# EAGLE schematic controls (EAGLE 6.6.0)
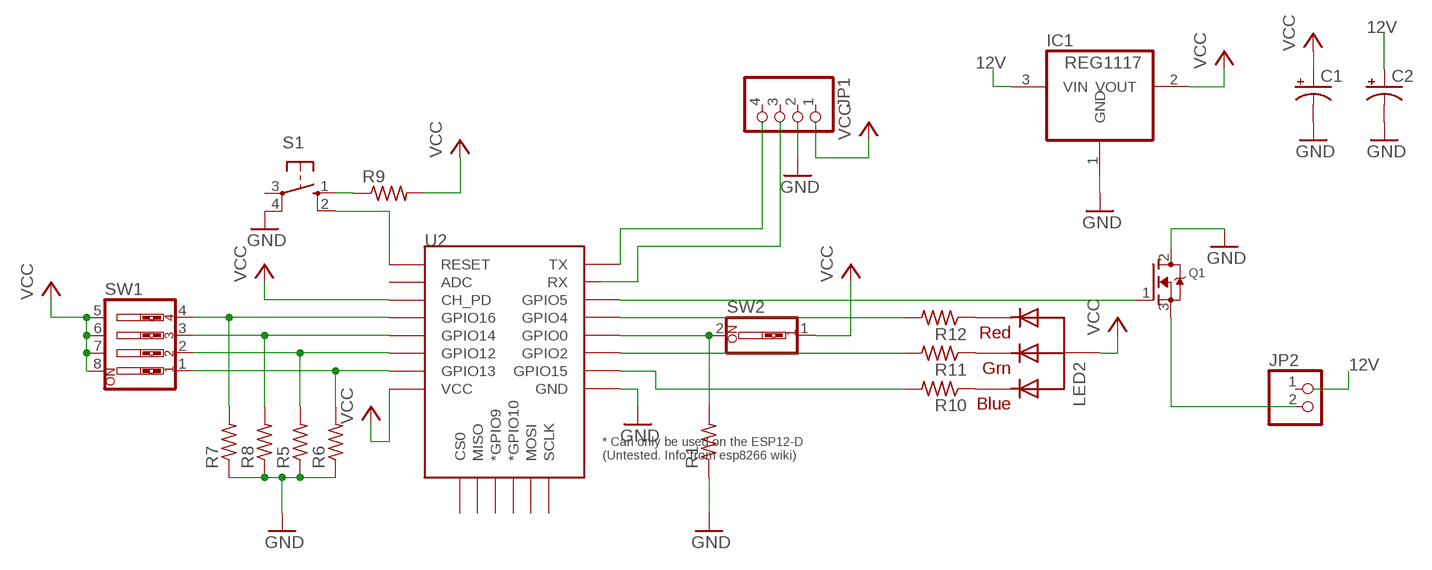
[diagram p0: schematic, sheet 1]

## Parts
C1  CPOL-USE2,5-6E  [E2,5-6E]
C2  CPOL-USE2,5-6E  [E2,5-6E]
IC1  REG1117  [SOT223]
JP1  PINHD-1X4  [1X04]
JP2  PINHD-1X2  [1X02]
LED2  RGBLED_CA-5MM  [LED5MMRGB]
Q1  MOSFET-NGDS_TO220V  [TO220V]
R1  R-US_0207/12  [0207/12]
R5  R-US_0207/12  [0207/12]
R6  R-US_0207/12  [0207/12]
R7  R-US_0207/12  [0207/12]
R8  R-US_0207/12  [0207/12]
R9  R-US_0207/12  [0207/12]
R10  R-US_0207/12  [0207/12]
R11  R-US_0207/12  [0207/12]
R12  R-US_0207/12  [0207/12]
S1  10-XX  [B3F-10XX]
SW1  SW_DIP-4  [EDG-04]
SW2  SW_DIP-1  [EDG-01]
U2  ESP12ESMD  [ESP12E-SMD]

## Nets
12V: IC1.3(VIN)
GND: C1.- C2.- IC1.1(GND) Q1.2(D) R1.1 R5.1 R6.1 R7.1 R8.1 S1.4(P1) U2.GND
N$1: R10.2 U2.GPIO15
N$2: R11.2 U2.GPIO2
N$3: Q1.1(G) U2.GPIO5
N$4: R9.1 S1.1(S)
N$5: S1.2(S1) U2.RESET
N$6: R6.2 SW1.1 U2.GPIO13
N$7: R5.2 SW1.2 U2.GPIO12
N$8: R8.2 SW1.3 U2.GPIO14
N$9: R7.2 SW1.4 U2.GPIO16
N$10: LED2.4(BLUE) R10.1
N$11: LED2.3(GREEN) R11.1
N$12: U2.TXD0(TX)
N$14: LED2.1(RED) R12.1
N$15: JP2.2 Q1.3(S)
N$16: R12.2 U2.GPIO4
N$17: R1.2 SW2.2 U2.GPIO0
N$18: C2.+
VCC: C1.+ IC1.2(VOUT) LED2.2(VCC) R9.2 SW1.5 SW1.6 SW1.7 SW1.8 SW2.1 U2.CH_PD U2.VCC
Unconnected: JP1.1 JP1.2 JP1.3 JP1.4 JP2.1 S1.3(P) U2.ADC U2.CS0 U2.GPIO9(*GPIO9) U2.GPIO10(*GPIO10) U2.MISO U2.MOSI U2.RXD0(RX) U2.SCLK

## Library data of the parts
C1 C2 = rcl:CPOL-US: POLARIZED CAPACITOR, American symbol
IC1 = burr-brown:REG1117: 800mA and 1A Low Dropout (LDO) Positive Regulator 1.8V, 2.5V, 2.85V, 3.3V, 5V, and Adj; MPN: REG1117; OC_FARNELL: 1097566; OC_NEWARK: 14P6981
JP1 = pinhead:PINHD-1X4: PIN HEADER
JP2 = pinhead:PINHD-1X2: PIN HEADER
LED2 = adafruit:RGBLED_CA: RGB LED, common-anode 5MM Staggered pins 5mm Piranha package http://www.ladyada.net/library/pcb/eaglelibrary.html
Q1 = adafruit:MOSFET-N: N-Channel Mosfet 2N7002E - 60V 260mA SOT23 [Digikey: 2N7002ET1GOSTR-ND] - REEL BSH103 - 30V 850mA SOT23 [Digikey: 568-5013-1-ND]
R1 R5-R12 = adafruit:R-US_: RESISTOR, American symbol
S1 = switch-omron:10-XX: OMRON SWITCH; MPN: B3F-1000; OC_FARNELL: 176432; OC_NEWARK: 36M3542
SW1 = special:SW_DIP-4: DIP SWITCH
SW2 = special:SW_DIP-1: DIP SWITCH
U2 = esp8266modules:ESP12E: ESP12E Module